# EAGLE design circuiteria v3 (EAGLE 9.6.2)
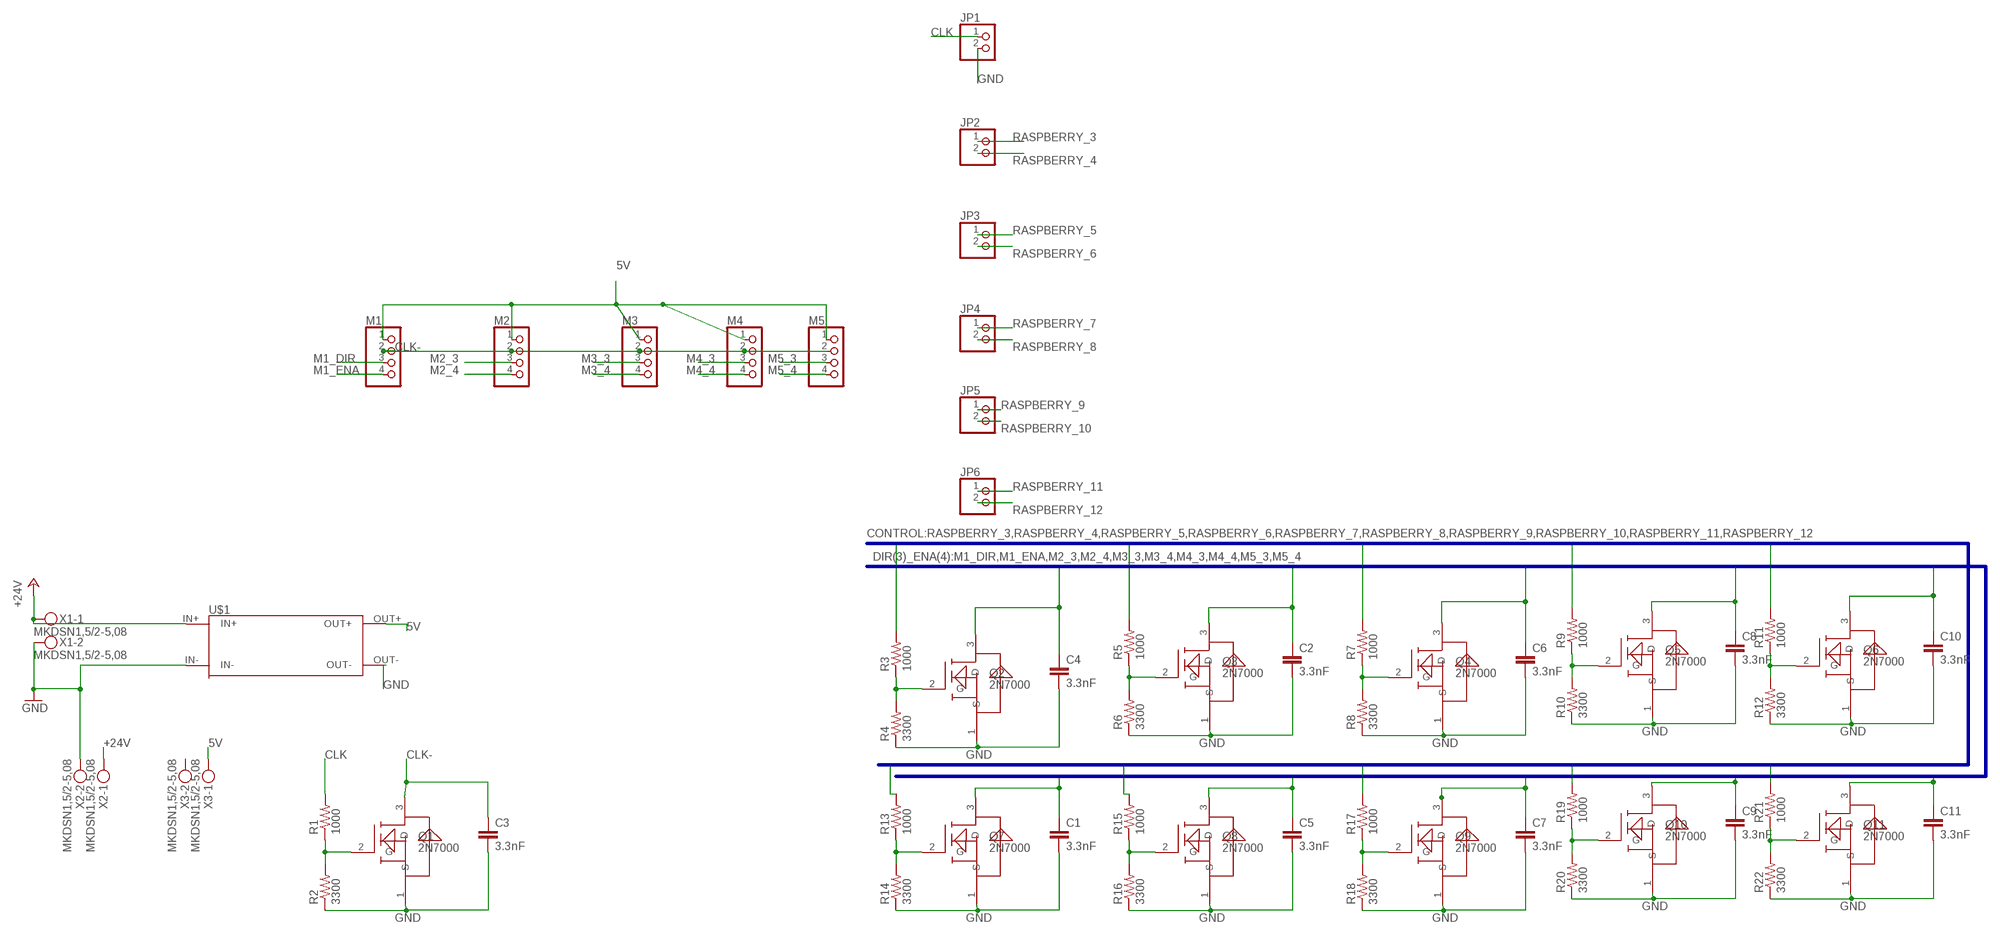
[diagram p0: schematic, sheet 1]

## Parts
C1  3.3nF  C-EU025-024X044  [C025-024X044]
C2  3.3nF  C-EU025-024X044  [C025-024X044]
C3  3.3nF  C-EU025-024X044  [C025-024X044]
C4  3.3nF  C-EU025-024X044  [C025-024X044]
C5  3.3nF  C-EU025-024X044  [C025-024X044]
C6  3.3nF  C-EU025-024X044  [C025-024X044]
C7  3.3nF  C-EU025-024X044  [C025-024X044]
C8  3.3nF  C-EU025-024X044  [C025-024X044]
C9  3.3nF  C-EU025-024X044  [C025-024X044]
C10  3.3nF  C-EU025-024X044  [C025-024X044]
C11  3.3nF  C-EU025-024X044  [C025-024X044]
JP1  PINHD-1X2  [1X02]
JP2  PINHD-1X2  [1X02]
JP3  PINHD-1X2  [1X02]
JP4  PINHD-1X2  [1X02]
JP5  PINHD-1X2  [1X02]
JP6  PINHD-1X2  [1X02]
M1  PINHD-1X4  [1X04]
M2  PINHD-1X4  [1X04]
M3  PINHD-1X4  [1X04]
M4  PINHD-1X4  [1X04]
M5  PINHD-1X4  [1X04]
Q1  2N7000  [2N7000]
Q2  2N7000  [2N7000]
Q3  2N7000  [2N7000]
Q4  2N7000  [2N7000]
Q5  2N7000  [2N7000]
Q6  2N7000  [2N7000]
Q7  2N7000  [2N7000]
Q8  2N7000  [2N7000]
Q9  2N7000  [2N7000]
Q10  2N7000  [2N7000]
Q11  2N7000  [2N7000]
R1  1000  R-US_0411/15  [0411/15]
R2  3300  R-US_0411/15  [0411/15]
R3  1000  R-US_0411/15  [0411/15]
R4  3300  R-US_0411/15  [0411/15]
R5  1000  R-US_0411/15  [0411/15]
R6  3300  R-US_0411/15  [0411/15]
R7  1000  R-US_0411/15  [0411/15]
R8  3300  R-US_0411/15  [0411/15]
R9  1000  R-US_0411/15  [0411/15]
R10  3300  R-US_0411/15  [0411/15]
R11  1000  R-US_0411/15  [0411/15]
R12  3300  R-US_0411/15  [0411/15]
R13  1000  R-US_0411/15  [0411/15]
R14  3300  R-US_0411/15  [0411/15]
R15  1000  R-US_0411/15  [0411/15]
R16  3300  R-US_0411/15  [0411/15]
R17  1000  R-US_0411/15  [0411/15]
R18  3300  R-US_0411/15  [0411/15]
R19  1000  R-US_0411/15  [0411/15]
R20  3300  R-US_0411/15  [0411/15]
R21  1000  R-US_0411/15  [0411/15]
R22  3300  R-US_0411/15  [0411/15]
U$1  LM2596  [LM2596]
X1  MKDSN1,5/2-5,08  [MKDSN1,5/2-5,08]
X2  MKDSN1,5/2-5,08  [MKDSN1,5/2-5,08]
X3  MKDSN1,5/2-5,08  [MKDSN1,5/2-5,08]

## Nets
5V: M1.1 M2.1 M3.1 M4.1 M5.1 U$1.OUT+ X3.1
+24V [power]: U$1.IN+ X1.1 X2.1
CLK [clock]: JP1.1 R1.2
CLK- [clock]: C3.1 M1.2 M2.2 M3.2 M4.2 M5.2 Q1.3(D)
GND [power]: C1.2 C2.2 C3.2 C4.2 C5.2 C6.2 C7.2 C8.2 C9.2 C10.2 C11.2 JP1.2 Q1.1(S) Q2.1(S) Q3.1(S) Q4.1(S) Q5.1(S) Q6.1(S) Q7.1(S) Q8.1(S) Q9.1(S) Q10.1(S) Q11.1(S) R2.1 R4.1 R6.1 R8.1 R10.1 R12.1 R14.1 R16.1 R18.1 R20.1 R22.1 U$1.IN- U$1.OUT- X1.2 X2.2
M1_DIR [dir y ena]: C4.1 M1.3 Q2.3(D)
M1_ENA [dir y ena]: C2.1 M1.4 Q3.3(D)
M2_3 [dir y ena]: C6.1 M2.3 Q4.3(D)
M2_4 [dir y ena]: C8.1 M2.4 Q5.3(D)
M3_3 [dir y ena]: C10.1 M3.3 Q6.3(D)
M3_4 [dir y ena]: C1.1 M3.4 Q7.3(D)
M4_3 [dir y ena]: C5.1 M4.3 Q8.3(D)
M4_4 [dir y ena]: C7.1 M4.4 Q9.3(D)
M5_3 [dir y ena]: C9.1 M5.3 Q10.3(D)
M5_4 [dir y ena]: C11.1 M5.4 Q11.3(D)
N$1 [clock]: Q1.2(G) R1.1 R2.2
N$3 [dir y ena]: Q2.2(G) R3.1 R4.2
N$4 [dir y ena]: Q3.2(G) R5.1 R6.2
N$5 [dir y ena]: Q4.2(G) R7.1 R8.2
N$6 [dir y ena]: Q5.2(G) R9.1 R10.2
N$7 [dir y ena]: Q6.2(G) R11.1 R12.2
N$8 [dir y ena]: Q7.2(G) R13.1 R14.2
N$9 [dir y ena]: Q8.2(G) R15.1 R16.2
N$10 [dir y ena]: Q9.2(G) R17.1 R18.2
N$11 [dir y ena]: Q10.2(G) R19.1 R20.2
N$12 [dir y ena]: Q11.2(G) R21.1 R22.2
RASPBERRY_3 [dir y ena]: JP2.1 R3.2
RASPBERRY_4 [dir y ena]: JP2.2 R5.2
RASPBERRY_5 [dir y ena]: JP3.1 R7.2
RASPBERRY_6 [dir y ena]: JP3.2 R9.2
RASPBERRY_7 [dir y ena]: JP4.1 R11.2
RASPBERRY_8 [dir y ena]: JP4.2 R13.2
RASPBERRY_9 [dir y ena]: JP5.1 R15.2
RASPBERRY_10 [dir y ena]: JP5.2 R17.2
RASPBERRY_11 [dir y ena]: JP6.1 R19.2
RASPBERRY_12 [dir y ena]: JP6.2 R21.2
Unconnected: X3.2

## Buses
DIR(3)_ENA(4):M1_DIR,M1_ENA,M2_3,M2_4,M3_3,M3_4,M4_3,M4_4,M5_3,M5_4
CONTROL:RASPBERRY_3,RASPBERRY_4,RASPBERRY_5,RASPBERRY_6,RASPBERRY_7,RASPBERRY_8,RASPBERRY_9,RASPBERRY_10,RASPBERRY_11,RASPBERRY_12

## Library data of the parts
C1-C11 = rcl:C-EU: CAPACITOR, European symbol; SPICEPREFIX: C
JP1-JP6 = pinhead:PINHD-1X2: PIN HEADER
M1-M5 = pinhead:PINHD-1X4: PIN HEADER
Q1-Q11 = local:2N7000
R1-R22 = rcl:R-US_: RESISTOR, American symbol; SPICEPREFIX: R
U$1 = local:LM2596
X1-X3 = local:MKDSN1,5/2-5,08: MKDSN 1,5/ 2-5,08 Printklemme Nennstrom: 13,5 A Nennspannung: 250 V Rastermaß: 5,08 mm Polzahl: 2 Anschlussart: Schraubanschluss Montage: Löten Anschlussrichtung Leiter/Platine: 0 ° Artikelnummer: 1729128 Source: http://eshop.phoenixcontact.com .. 1729128.pdf

## Net classes
1 power: width 2.23 mm
2 control: width 0.025 mm
3 dir y ena: width 0.002 mm
4 clock: width 0.02 mm

## Board
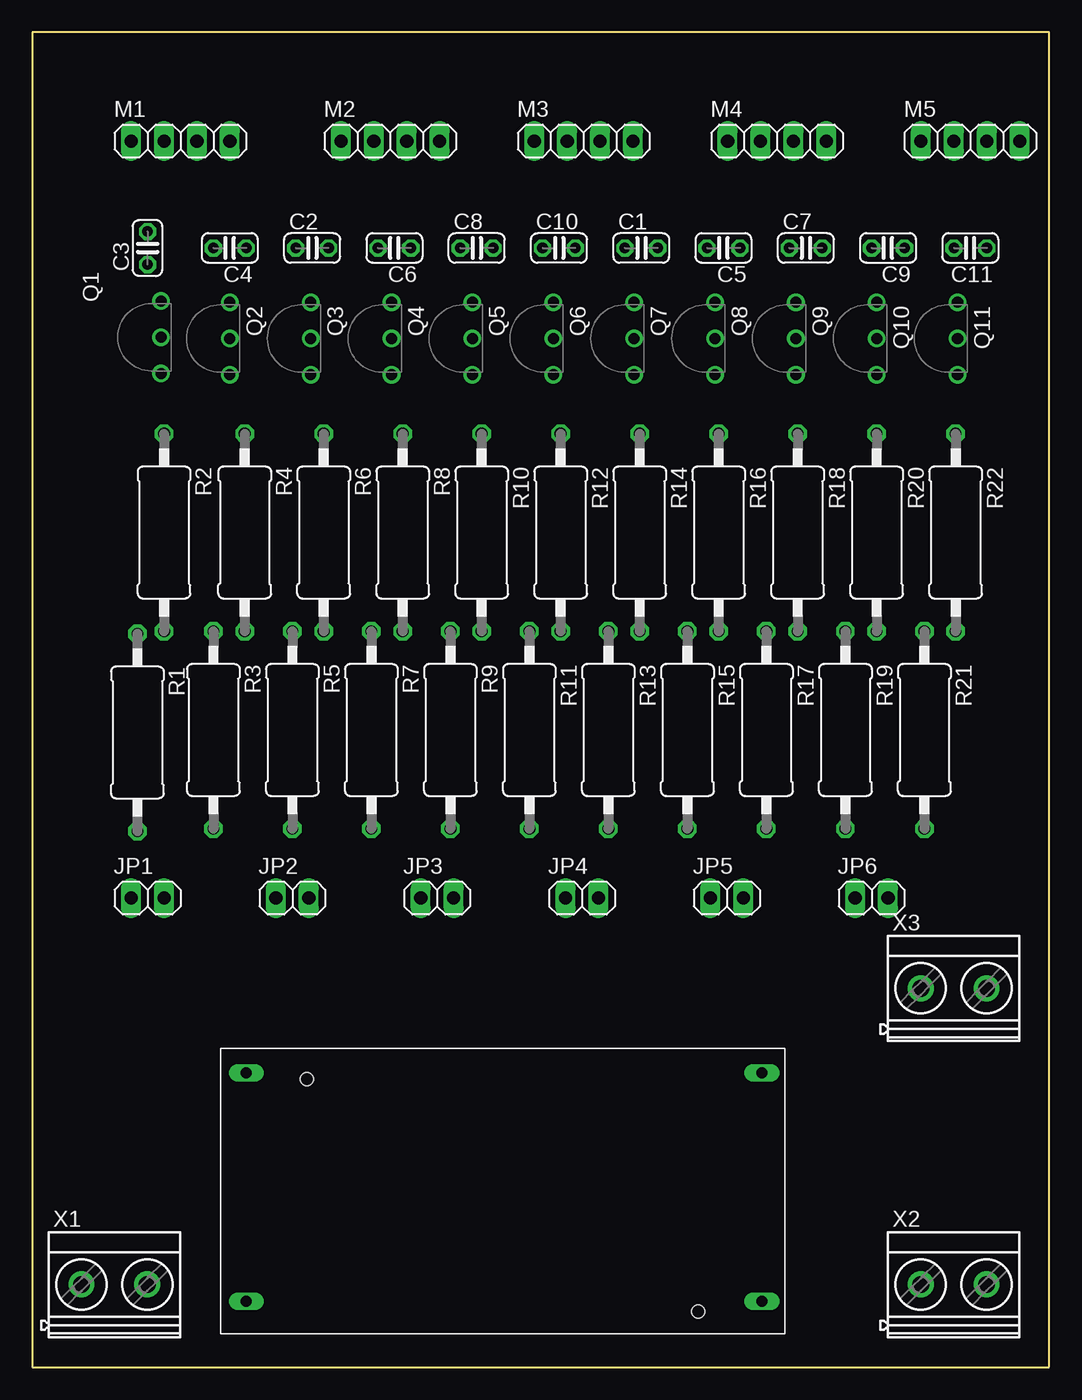
[diagram p1: board, top side]
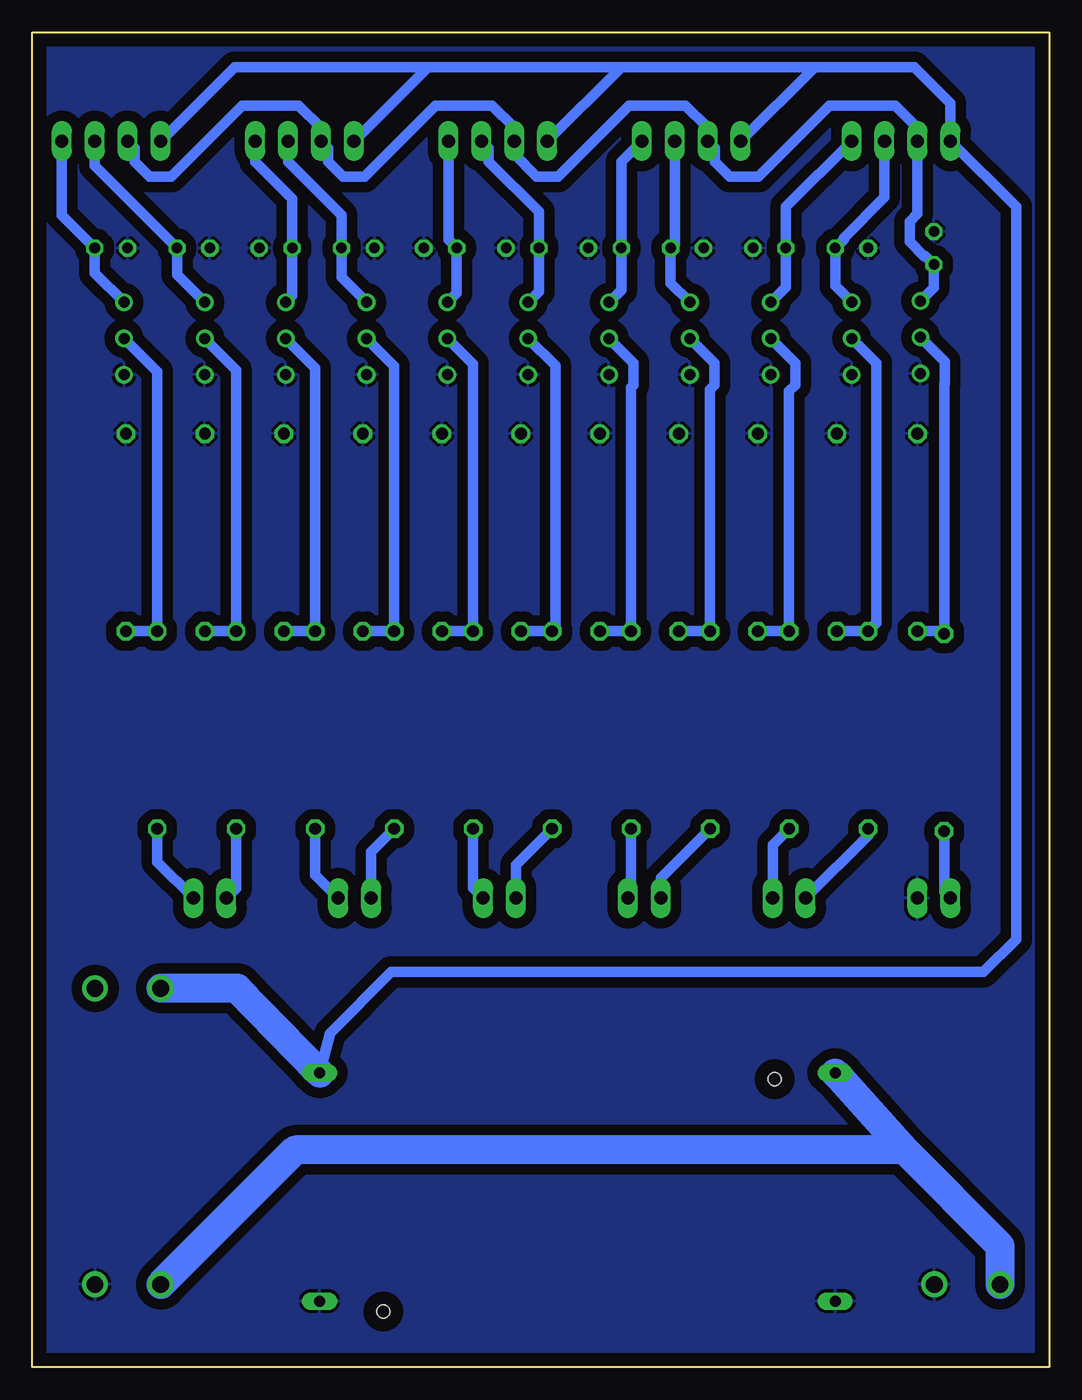
[diagram p2: board, bottom side, seen from below]

Size 78.47 x 103 mm. Coordinates in mm from the lower left corner, seen from the top.
Outline: 0,0 78.47,0 78.47,103 0,103 0,0
Copper layers (1*16): Top 0.035mm / dielectric 1.5mm / Bottom 0.035mm
Design rules "default *": minimum track width 0.813mm, minimum drill 0.813mm, track to track 0.813mm, track to pad 0.813mm, pad to pad 0.813mm, via to via 0.813mm, smd to smd 6mil, copper to edge 40mil, drill to drill 6mil, minimum pad ring 10mil, minimum via ring 8mil, stop-mask expansion 4mil, vias tented up to drill 0mil, thermal gap 10mil

### Footprints (pad centres in the part's own frame; a part is rotated, then mirrored left to right if it is on the bottom)
C025-024X044 = drill 0.813 octagon: 1 -1.27,0; 2 1.27,0
1X02 = drill 1.016 long: 1 -1.27,0; 2 1.27,0
1X04 = drill 1.016 long: 1 -3.81,0; 2 -1.27,0; 3 1.27,0; 4 3.81,0
2N7000 = drill 0.85: 1 2.8,0; 2 0,0; 3 -2.8,0
0411/15 = drill 0.914 octagon: 1 -7.62,0; 2 7.62,0
LM2596 = drill 0.85 long: IN+ 0,17.62; IN- 0,0; OUT+ 39.79,17.62; OUT- 39.79,0 | hole 1: 4.67,17.14; 34.88,-0.8
MKDSN1,5/2-5,08 = drill 1.3 pad 2: 1 -2.561,0.025; 2 2.519,0.025

### Placement (x,y rotation side)
C1  46.99,86.36 0 top
C2  21.59,86.36 0 top
C3  8.89,86.36 90 top
C4  15.24,86.36 180 top
C5  53.34,86.36 180 top
C6  27.94,86.36 180 top
C7  59.69,86.36 0 top
C8  34.29,86.36 0 top
C9  66.04,86.36 180 top
C10  40.64,86.36 0 top
C11  72.39,86.36 180 top
JP1  8.89,36.2 0 top
JP2  20.07,36.2 0 top
JP3  31.24,36.2 0 top
JP4  42.42,36.2 0 top
JP5  53.59,36.2 0 top
JP6  64.77,36.2 0 top
M1  11.43,94.61 0 top
M2  27.62,94.61 0 top
M3  42.55,94.61 0 top
M4  57.47,94.61 0 top
M5  72.39,94.61 0 top
Q1  9.93,79.48 270 top
Q2  15.24,79.38 270 top
Q3  21.48,79.38 270 top
Q4  27.72,79.38 270 top
Q5  33.96,79.38 270 top
Q6  40.2,79.38 270 top
Q7  46.44,79.38 270 top
Q8  52.68,79.38 270 top
Q9  58.92,79.38 270 top
Q10  65.16,79.38 270 top
Q11  71.4,79.38 270 top
R1  8.1,48.98 270 top
R2  10.16,64.41 270 top
R3  13.97,49.17 270 top
R4  16.38,64.41 270 top
R5  20.07,49.17 270 top
R6  22.48,64.41 270 top
R7  26.16,49.17 270 top
R8  28.58,64.41 270 top
R9  32.26,49.17 270 top
R10  34.67,64.41 270 top
R11  38.36,49.17 270 top
R12  40.77,64.41 270 top
R13  44.45,49.17 270 top
R14  46.87,64.41 270 top
R15  50.55,49.17 270 top
R16  52.96,64.41 270 top
R17  56.65,49.17 270 top
R18  59.06,64.41 270 top
R19  62.74,49.17 270 top
R20  65.16,64.41 270 top
R21  68.84,49.17 270 top
R22  71.25,64.41 270 top
U$1  16.51,5.08 0 top
X1  6.35,6.35 0 top
X2  71.12,6.35 0 top
X3  71.12,29.21 0 top

### Tracks (layer width: path | path; a pad name or v marks a point on that pad's centre or on a via)
5V
  Bottom 0.813: 18.1,100.33 M2.1 | 18.1,100.33 33.02,100.33 | M3.1 33.02,100.33 | 33.02,100.33 47.94,100.33 | 47.94,100.33 M4.1 | 47.94,100.33 62.87,100.33 M5.1 | 18.1,100.33 10.4,100.33 7.62,97.55 M1.1 2.54,89.53 2.54,33.02 5.08,30.48 50.8,30.48 55.51,25.77 U$1.OUT+
  Bottom 2.23: U$1.OUT+ 62.66,29.23 X3.1
+24V
  Bottom 2.23: U$1.IN+ 11.19,16.75 | 11.19,16.75 3.79,9.36 X1.1 | 11.19,16.75 58.18,16.75 X2.1
CLK
  Bottom 0.813: R1.2 8.1,36.68 JP1.1
CLK-
  Bottom 0.813: M5.2 70.56,94.06 70.56,93.03 69.4,91.87 67.76,91.87 62.27,97.36 57.92,97.36 56.2,95.64 M4.2 55.64,94.06 55.64,93.03 54.48,91.87 52.84,91.87 47.35,97.36 42.99,97.36 41.27,95.64 M3.2 41.27,93.59 39.56,91.87 37.91,91.87 32.43,97.36 28.07,97.36 26.35,95.64 M2.2 25.79,94.06 25.79,93.03 24.63,91.87 22.43,91.87 16.94,97.36 11.88,97.36 10.16,95.64 M1.2 10.16,89.02 10.77,88.41 10.77,86.85 9.67,85.75 9.55,85.75 C3.1 8.89,83.32 Q1.3
GND
  pour Bottom: 0,0 78.74,0 78.74,102.87 0,102.87
M1_DIR
  Bottom 0.813: Q2.3 16.51,83.44 C4.1 15.85,87.02 15.85,87.14 12.7,90.29 M1.3
M1_ENA
  Bottom 0.813: Q3.3 20.32,83.33 C2.1 20.32,89.53 M1.4
M2_3
  Bottom 0.813: Q4.3 29.21,83.67 C6.1 28.89,86.68 M2.3
M2_4
  Bottom 0.813: Q5.3 33.02,83.12 C8.1 33.02,93.03 M2.4
M3_3
  Bottom 0.813: Q6.3 39.37,83.01 C10.1 39.37,89.15 43.26,93.03 43.26,94.06 M3.3
M3_4
  Bottom 0.813: Q7.3 45.72,82.9 C1.1 46.35,87 M3.4
M4_3
  Bottom 0.813: Q8.3 54.61,84.1 C5.1 54.61,88.9 58.74,93.03 M4.3
M4_4
  Bottom 0.813: Q9.3 58.42,82.68 C7.1 58.42,90.17 61.28,93.03 M4.4
M5_3
  Bottom 0.813: Q10.3 67.31,84.32 C9.1 73.66,92.71 M5.3
M5_4
  Bottom 0.813: Q11.3 73.66,84.43 C11.1 76.2,88.9 M5.4
N$1
  Bottom 0.813: R2.2 8.29,56.79 R1.1 8.1,75.82 8.03,75.89 8.03,77.58 Q1.2
N$3
  Bottom 0.813: R4.2 R3.1 13.34,57.42 13.34,77.48 Q2.2
N$4
  Bottom 0.813: R6.2 R5.1 20.07,75.3 19.58,75.79 19.58,77.48 Q3.2
N$5
  Bottom 0.813: R8.2 R7.1 26.16,75.45 25.82,75.79 25.82,77.48 Q4.2
N$6
  Bottom 0.813: R10.2 R9.1 32.26,75.59 32.06,75.79 32.06,77.48 Q5.2
N$7
  Bottom 0.813: R12.2 R11.1 38.1,57.04 38.1,77.27 Q6.2
N$8
  Bottom 0.813: R14.2 R13.1 44.45,77.39 Q7.2
N$9
  Bottom 0.813: R16.2 R15.1 50.55,77.24 Q8.2
N$10
  Bottom 0.813: R18.2 R17.1 56.65,77.1 Q9.2
N$11
  Bottom 0.813: R20.2 R19.1 62.74,76.96 Q10.2
N$12
  Bottom 0.813: R22.2 R21.1 68.84,76.81 Q11.2
RASPBERRY_3
  Bottom 0.813: JP2.1 13.97,41.02 R3.2
RASPBERRY_4
  Bottom 0.813: R5.2 21.34,40.28 JP2.2
RASPBERRY_5
  Bottom 0.813: R7.2 29.97,37.74 JP3.1
RASPBERRY_6
  Bottom 0.813: JP3.2 32.26,36.45 R9.2
RASPBERRY_7
  Bottom 0.813: R11.2 41.15,38.76 JP4.1
RASPBERRY_8
  Bottom 0.813: JP4.2 44.45,36.96 R13.2
RASPBERRY_9
  Bottom 0.813: R15.2 52.32,39.77 JP5.1
RASPBERRY_10
  Bottom 0.813: JP5.2 56.65,37.98 R17.2
RASPBERRY_11
  Bottom 0.813: R19.2 62.74,36.95 JP6.1
RASPBERRY_12
  Bottom 0.813: JP6.2 68.84,38.99 R21.2